# EAGLE design jeep beacon (EAGLE 9.3.2)
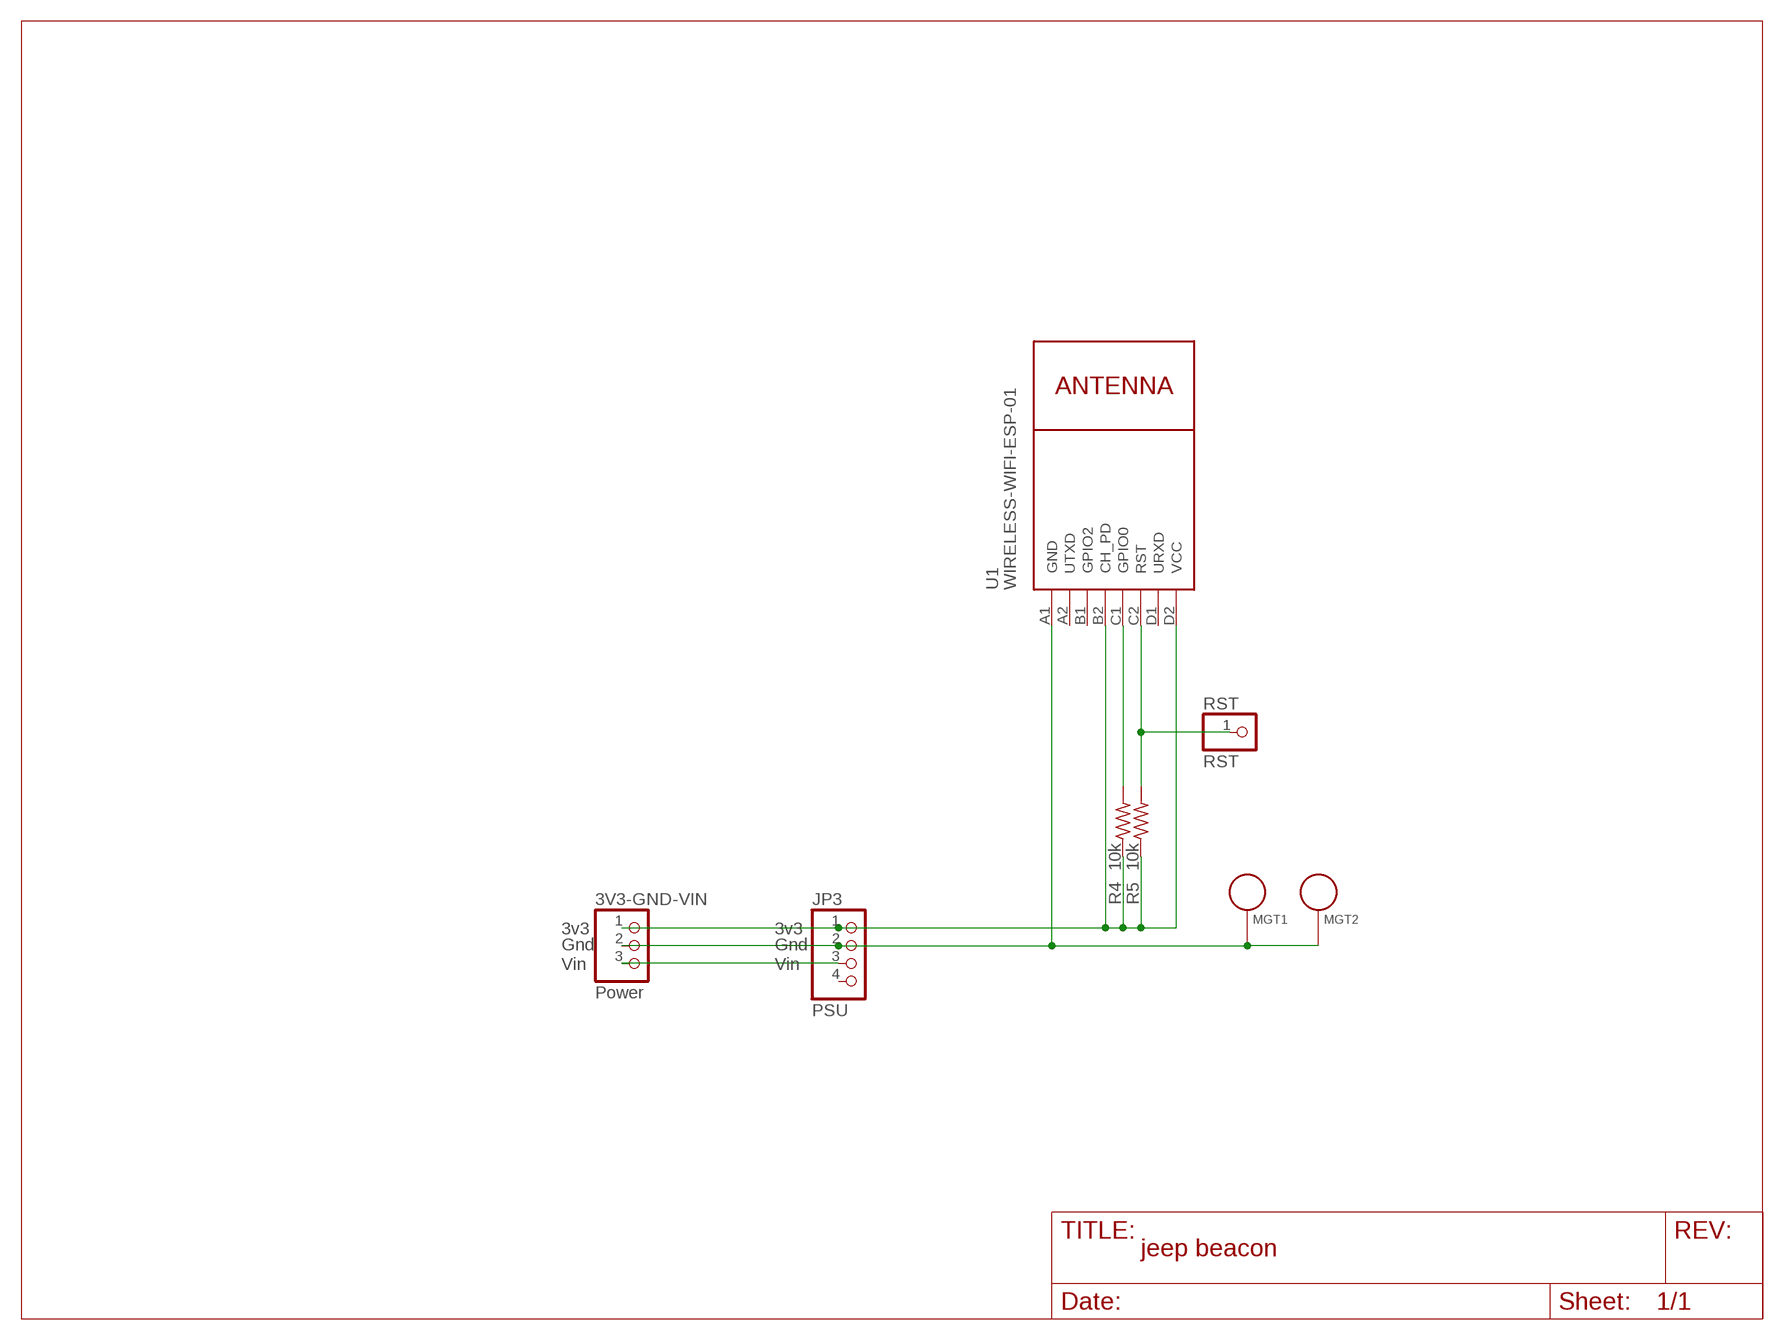
[diagram p0: schematic, sheet 1]

## Parts
3V3-GND-VIN  Power  PINHD-1X3  [1X03]
JP3  PSU  PINHD-1X4  [1X04]
MGT1  BEAGLEBONEBLACK_MOUNTING_HOLE  [BEAGLEBONEBLACK_MOUNTING_HOLE]
MGT2  BEAGLEBONEBLACK_MOUNTING_HOLE  [BEAGLEBONEBLACK_MOUNTING_HOLE]
R4  10k  R-US_0207/10  [0207/10]
R5  10k  R-US_0207/10  [0207/10]
RST  RST  PINHD-1X1  [1X01]
U1  WIRELESS-WIFI-ESP-01  [WIRELESS-WIFI-ESP-01]

## Nets
3V3: 3V3-GND-VIN.1 JP3.1 R4.1 R5.1 U1.B2(CH_PD) U1.D2(VCC)
GND: 3V3-GND-VIN.2 JP3.2 MGT1.P$1 MGT2.P$1 U1.A1(GND)
N$3: 3V3-GND-VIN.3 JP3.3
N$4: R4.2 U1.C1(GPIO0)
N$5: R5.2 RST.1 U1.C2(RST)
Unconnected: JP3.4 U1.A2(UTXD) U1.B1(GPIO2) U1.D1(URXD)

## Notes on the sheet
- 3v3 | 3v3
- Gnd | Gnd
- Vin | Vin

## Library data of the parts
3V3-GND-VIN = pinhead:PINHD-1X3: PIN HEADER
JP3 = pinhead:PINHD-1X4: PIN HEADER
MGT1 MGT2 = BeagleBone_Black_Wireless:BEAGLEBONEBLACK_MOUNTING_HOLE: Chassis Mounting Hole w/GND connection ability
R4 R5 = BeagleBone_Black_Wireless:R-US_: RESISTOR, American symbol
RST = adafruit:PINHD-1X1: Pin header 1x1 for 0.1" spacing With round pins
U1 = diy-modules:WIRELESS-WIFI-ESP-01: Wireless Wi-Fi ESP-01 Module based on ESP8266 chip Click here to find device on ebay.com <http://www.ebay.com/sch/esp8266+esp+01+transceiver>

## Board
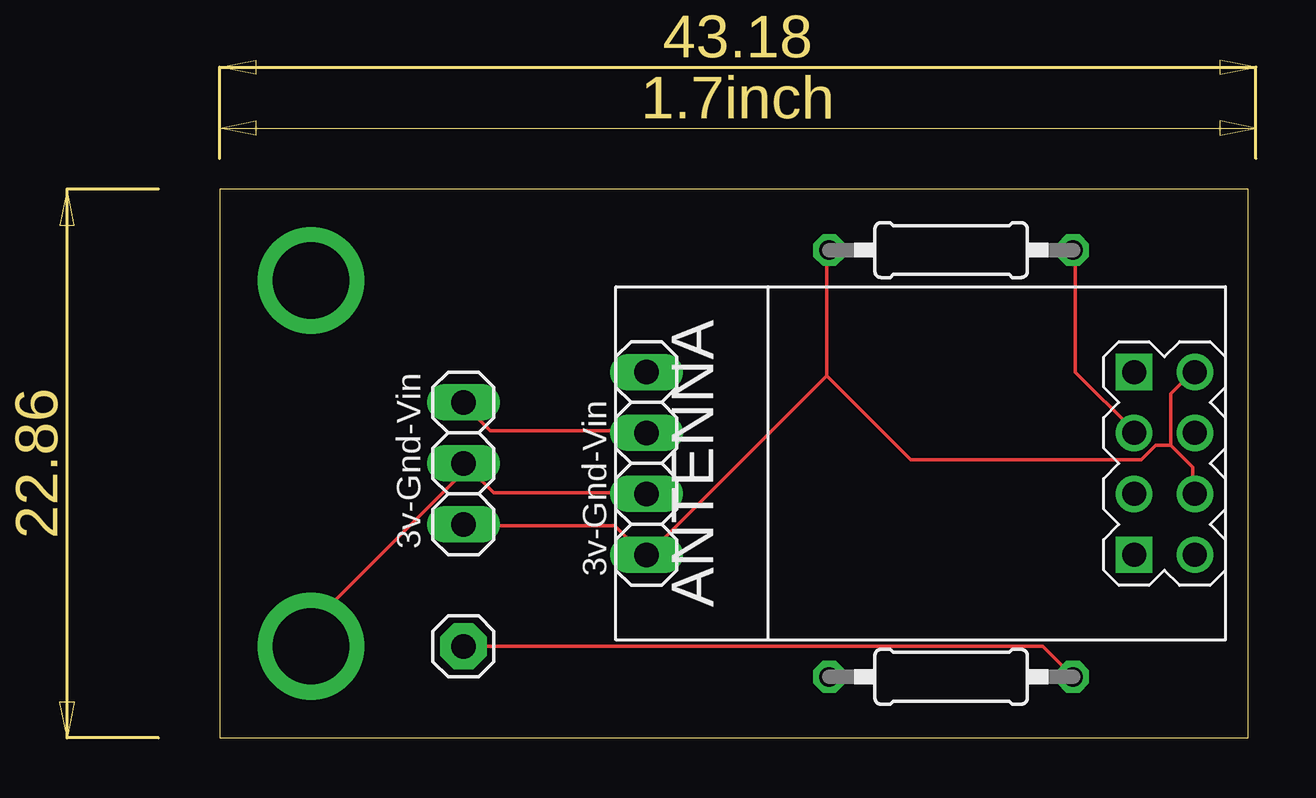
[diagram p1: board, top side]
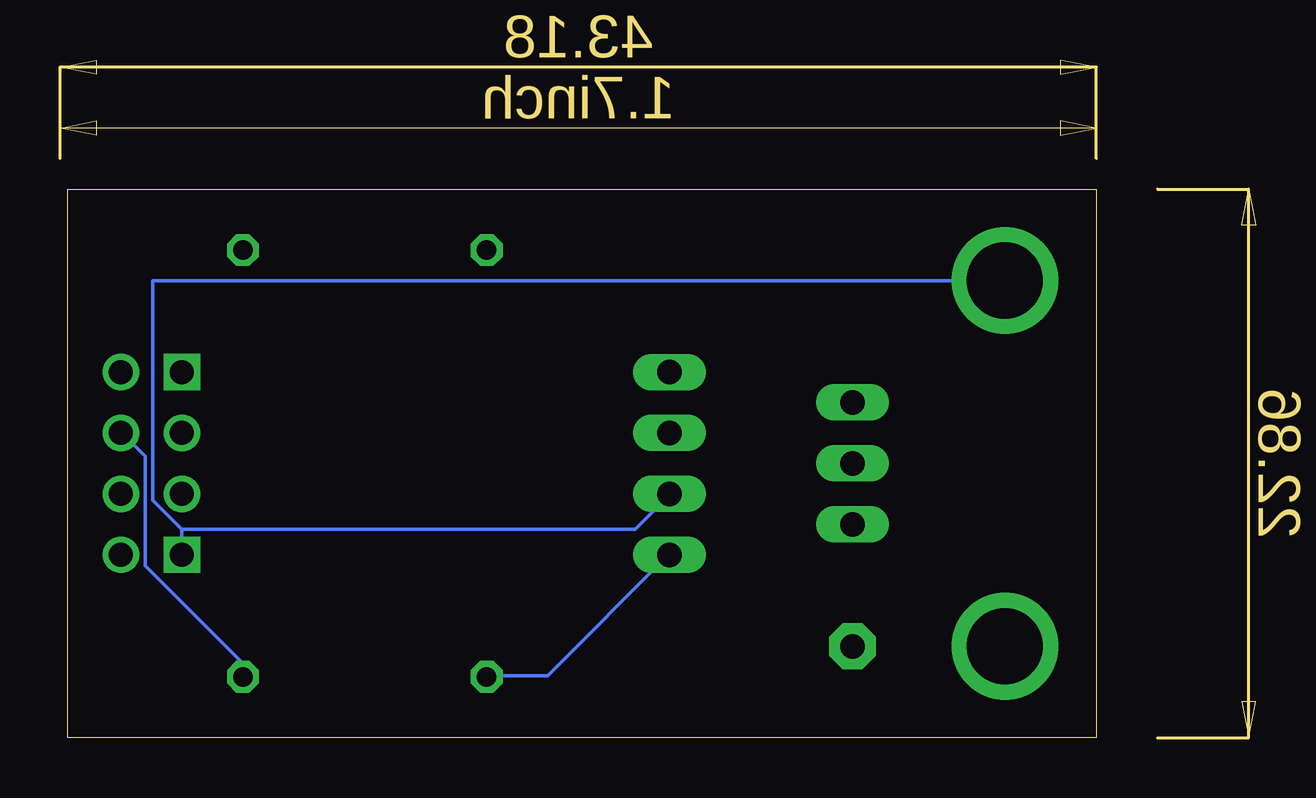
[diagram p2: board, bottom side, seen from below]

Size 42.85 x 22.85 mm. Coordinates in mm from the lower left corner, seen from the top.
Outline: 0,0 42.85,0 42.85,22.85 0,22.85 0,0
Copper layers (1*16): Top 0.035mm / dielectric 1.5mm / Bottom 0.035mm
Design rules "default": minimum track width 6mil, minimum drill 0.35mm, track to track 6mil, track to pad 6mil, pad to pad 6mil, via to via 6mil, smd to smd 6mil, copper to edge 40mil, drill to drill 6mil, minimum pad ring 10mil, minimum via ring 8mil, stop-mask expansion 4mil, vias tented up to drill 0mil, thermal gap 10mil

### Footprints (pad centres in the part's own frame; a part is rotated, then mirrored left to right if it is on the bottom)
1X03 = drill 1.016 long: 1 -2.54,0; 2 0,0; 3 2.54,0
1X04 = drill 1.016 long: 1 -3.81,0; 2 -1.27,0; 3 1.27,0; 4 3.81,0
BEAGLEBONEBLACK_MOUNTING_HOLE = drill 3.175 pad 4.445: P$1 0,0
0207/10 = drill 0.813 octagon: 1 -5.08,0; 2 5.08,0
1X01 = drill 1.016 pad 1.93 octagon: 1 0,0
WIRELESS-WIFI-ESP-01 = drill 1 square: A1 -8.89,3.81; D1 -8.89,-3.81 | drill 1: A2 -11.43,3.81; B1 -8.89,1.27; B2 -11.43,1.27; C1 -8.89,-1.27; C2 -11.43,-1.27; D2 -11.43,-3.81

### Placement (x,y rotation side)
3V3-GND-VIN  10.16,11.43 90 top
JP3  17.78,11.43 90 top
MGT1  3.81,19.05 0 top
MGT2  3.81,3.81 0 top
R4  30.48,20.32 0 top
R5  30.48,2.54 0 top
RST  10.16,3.81 0 top
U1  29.21,11.43 180 top

### Tracks (layer width: path | path; a pad name or v marks a point on that pad's centre or on a via)
3V3
  Top 0.152: 39.62,12.19 40.54,11.28 40.54,10.21 U1.B2 | 39.62,12.19 39.62,14.33 40.54,15.24 U1.D2 | 25.3,15.09 25.3,20.27 R4.1 | 25.3,15.09 17.83,7.62 JP3.1 17.68,7.62 16.46,8.84 10.21,8.84 3V3-GND-VIN.1 | 39.62,12.19 39.01,12.19 38.41,11.58 28.8,11.58 25.3,15.09
  Bottom 0.152: R5.1 25.3,2.59 22.86,2.59 17.83,7.62 JP3.1
GND
  Top 0.152: 10.36,11.28 10.21,11.43 3V3-GND-VIN.2 10.36,11.28 | 10.36,11.28 11.43,10.21 17.68,10.21 JP3.2 | 10.36,11.28 3.81,4.72 MGT2.P$1
  Bottom 0.152: 38.1,8.69 U1.A1 | 38.1,8.69 39.32,9.91 39.32,19.05 MGT1.P$1 | 38.1,8.69 19.2,8.69 17.83,10.06 JP3.2
N$3
  Top 0.152: JP3.3 17.68,12.8 11.28,12.8 10.21,13.87 3V3-GND-VIN.3
N$4
  Top 0.152: R4.2 35.66,20.27 35.66,15.24 38.1,12.8 U1.C1
N$5
  Top 0.152: RST.1 34.29,3.81 R5.2
  Bottom 0.152: R5.2 35.66,2.59 35.66,3.2 39.62,7.16 39.62,11.73 40.54,12.65 U1.C2

### Text on the board
tNames: 3v-Gnd-Vin | 3v-Gnd-Vin